# Altium schematic sheet mcu.SchDoc
size A4
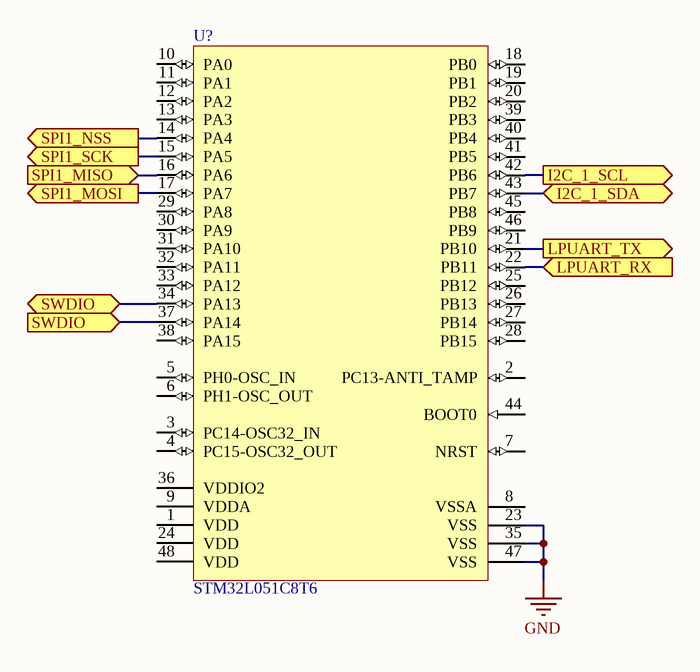
[diagram p0: mcu.SchDoc]

## Parts
U?  STM32L051C8T6  [STM-LQFP48_L]

## Ports
I2C_1_SCL (out), I2C_1_SDA (bidir), LPUART_RX (in), LPUART_TX (out), SPI1_MISO (in), SPI1_MOSI (out), SPI1_NSS (out), SPI1_SCK (out), SWDIO (bidir), SWDIO (in)

## Nets
GND: U?.23(VSS) U?.35(VSS) U?.47(VSS)
I2C_1_SCL: U?.42(PB6) ; port I2C_1_SCL
I2C_1_SDA: U?.43(PB7) ; port I2C_1_SDA
LPUART_RX: U?.22(PB11) ; port LPUART_RX
LPUART_TX: U?.21(PB10) ; port LPUART_TX
SPI1_MISO: U?.16(PA6) ; port SPI1_MISO
SPI1_MOSI: U?.17(PA7) ; port SPI1_MOSI
SPI1_NSS: U?.14(PA4) ; port SPI1_NSS
SPI1_SCK: U?.15(PA5) ; port SPI1_SCK
SWDIO: U?.34(PA13) U?.37(PA14) ; port SWDIO

Not connected (* = marked no-connect by the designer): U? 1(VDD) 2(PC13-ANTI_TAMP) 3(PC14-OSC32_IN) 4(PC15-OSC32_OUT) 5(PH0-OSC_IN) 6(PH1-OSC_OUT) 7(NRST) 8(VSSA) 9(VDDA) 10(PA0) 11(PA1) 12(PA2) 13(PA3) 18(PB0) 19(PB1) 20(PB2) 24(VDD) 25(PB12) 26(PB13) 27(PB14) 28(PB15) 29(PA8) 30(PA9) 31(PA10) 32(PA11) 33(PA12) 36(VDDIO2) 38(PA15) 39(PB3) 40(PB4) 41(PB5) 44(BOOT0) 45(PB8) 46(PB9) 48(VDD)

## Library data of the parts
U? = CMP-1546-00003-1: Ultra-Low-Power ARM Cortex-M0+ MCU, 64 KB Flash, 1.8 to 3.6 V, -40 to 85 degC, 48-Pin LQFP, RoHS, Tray; RAM: 8 KB; Flash: 64 KB; Data EEPROM: 2 KB; VDD Max: 3.6 V; VDD Min: 1.8 V; PartNumber: STM32L051C8T6; ComponentLink3URL: http://www.st.com/st-web-ui/static/active/en/resource/technical/document/datasheet/DM00058181.pdf; ComponentLink1URL: http://www.st.com/web/en/home.html; Temperature Min: -40 degC; DatasheetVersion: Rev. 4; ComponentLink3Description: Package Specification; Mounting Technology: Surface Mount; ComponentLink1Description: Manufacturer URL; Packing: Tray; Temperature Max: 85 degC; ComponentLink2URL: http://www.st.com/st-web-ui/static/active/en/resource/technical/document/datasheet/DM00108219.pdf; PackageDescription: 48-Pin Frame Chip Scale Package, Body 7 x 7 mm, Pitch 0.5 mm; ComponentLink2Description: Datasheet; RoHS: TRUE